# EAGLE schematic 22257 v8 (EAGLE 9.7.0)

## Sheet 1 of 2: Microzed Headers
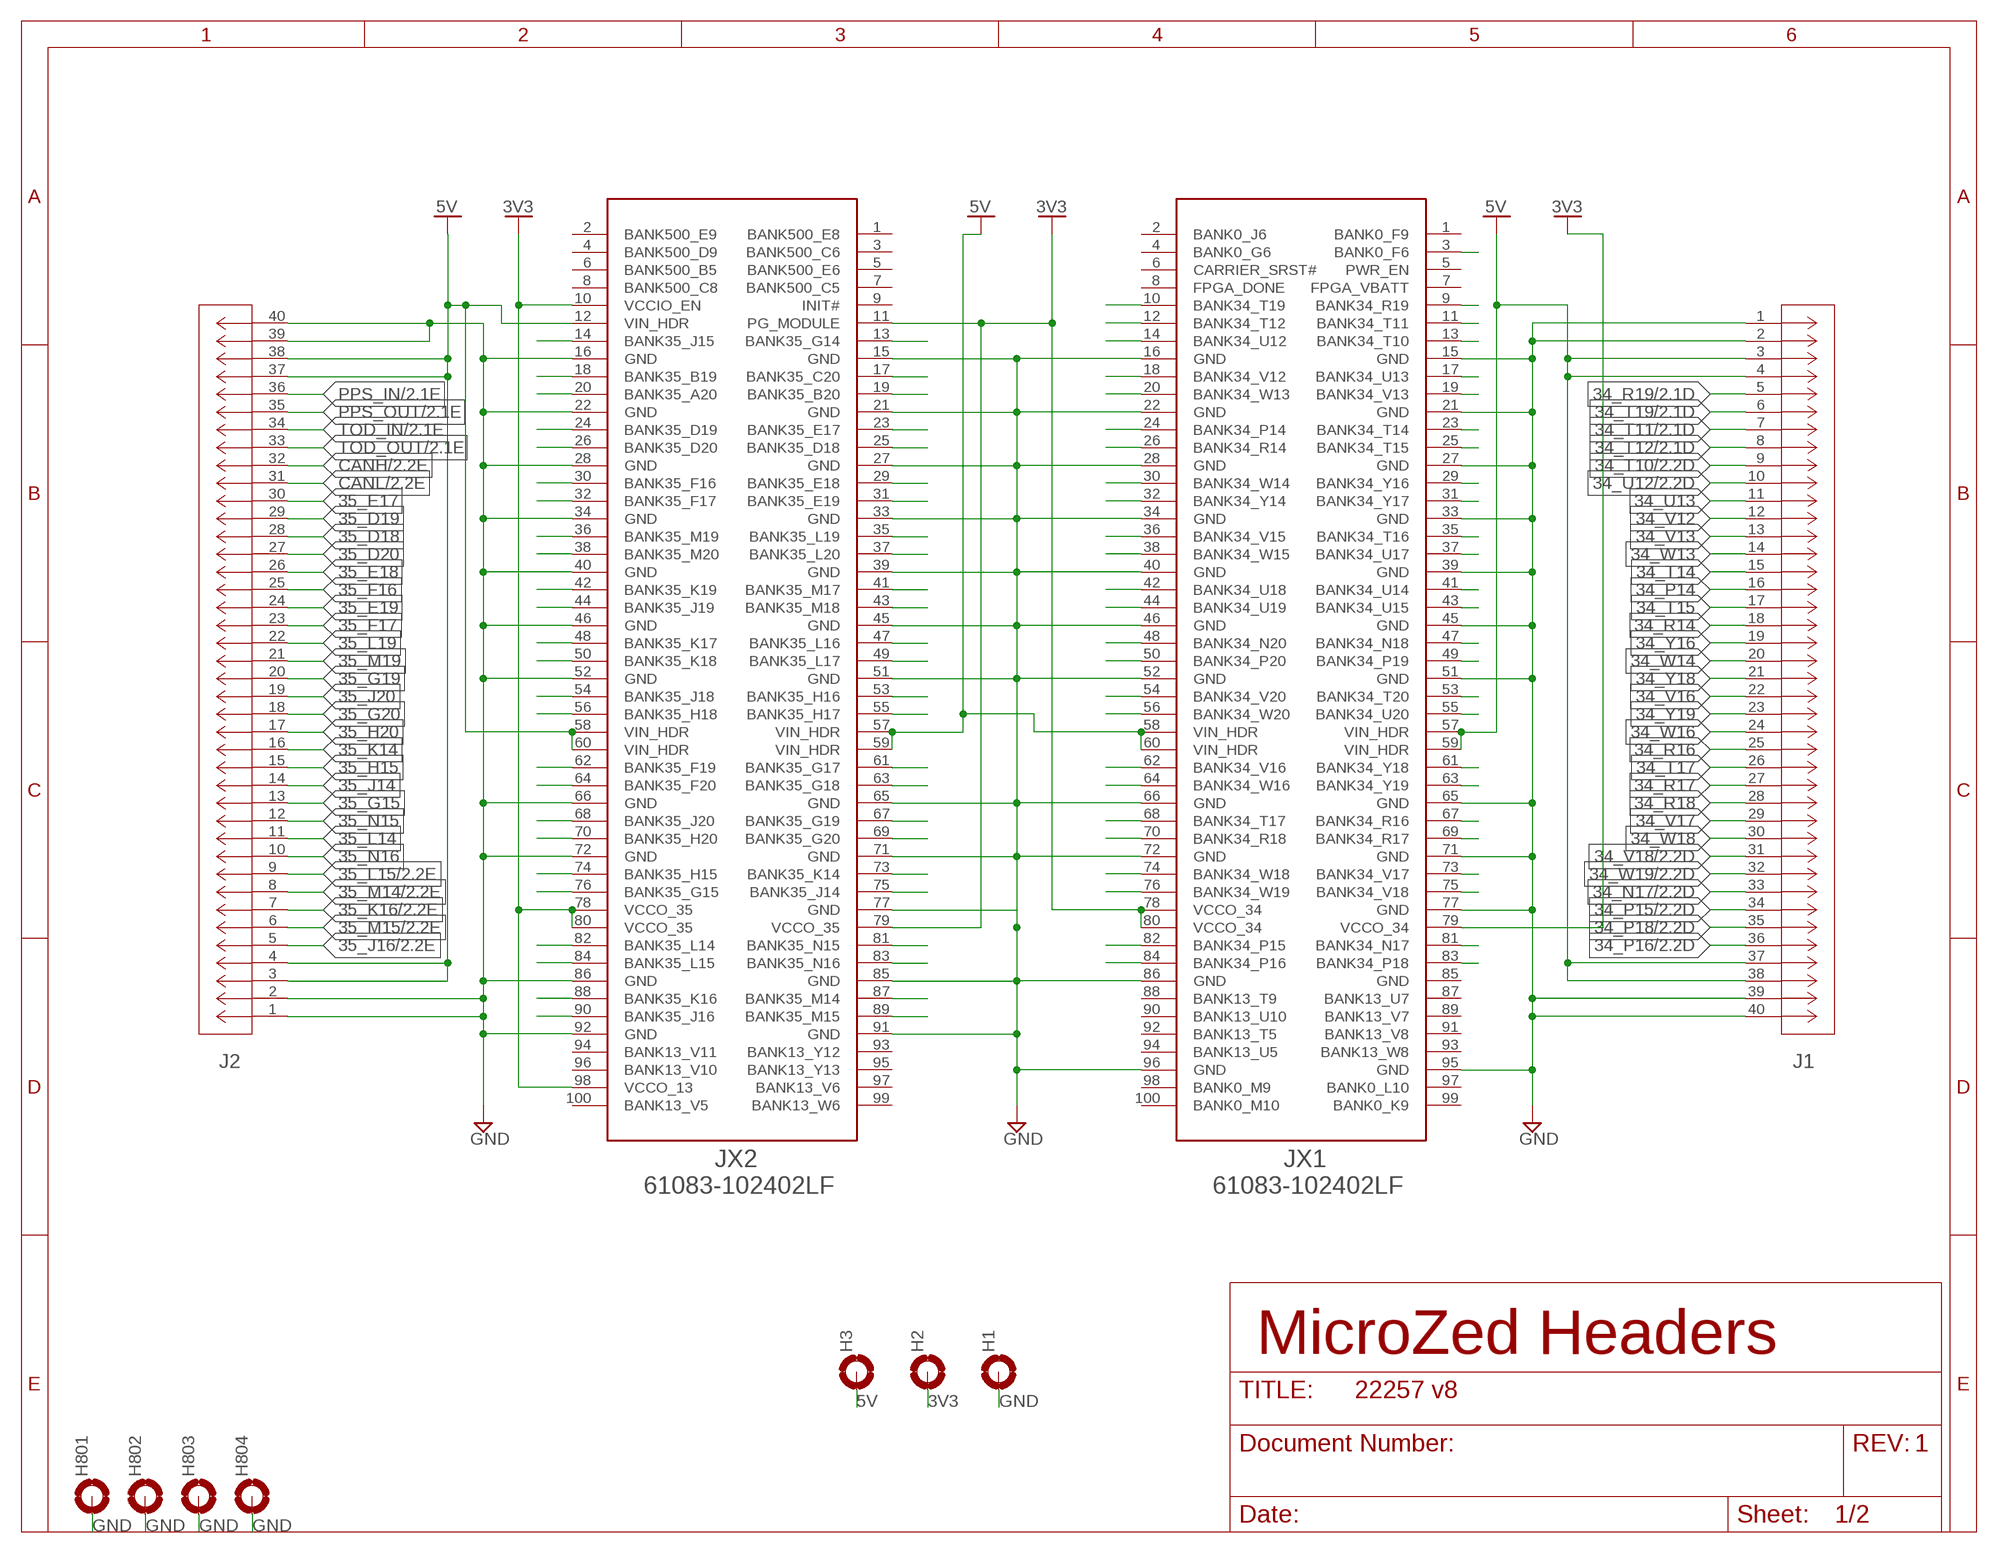
[diagram p0: schematic, sheet 1]

### Parts
H1  MOUNT-PAD-ROUND5.0  [5,0-PAD]
H2  MOUNT-PAD-ROUND5.0  [5,0-PAD]
H3  MOUNT-PAD-ROUND5.0  [5,0-PAD]
H801  MOUNT-PAD-ROUND5.0  [5,0-PAD]
H802  MOUNT-PAD-ROUND5.0  [5,0-PAD]
H803  MOUNT-PAD-ROUND5.0  [5,0-PAD]
H804  MOUNT-PAD-ROUND5.0  [5,0-PAD]
J1  TD-120-G-AACON40_2X20_TU_HTS_SAI  [CON40_2X20_TU_HTS_SAI]
J2  TD-120-G-AACON40_2X20_TU_HTS_SAI  [CON40_2X20_TU_HTS_SAI]
JX1  61083-102402LF  61083-102402LF-JX1  [61083-102402LF]
JX2  61083-102402LF  61083-102402LF-JX2  [61083-102402LF]

### Nets
3V3: H2.B5(MOUNT) JX1.78(VCCO_34) JX1.79(VCCO_34) JX1.80(VCCO_34) JX2.10(VCCIO_EN) JX2.11(PG_MODULE) JX2.78(VCCO_35) JX2.79(VCCO_35) JX2.80(VCCO_35) JX2.98(VCCO_13) ; also sheet 2
5V: H3.B5(MOUNT) J1.3 J1.4 J1.37 J1.38 J2.3 J2.4 J2.37 J2.38 JX1.57(VIN_HDR) JX1.58(VIN_HDR) JX1.59(VIN_HDR) JX1.60(VIN_HDR) JX2.12(VIN_HDR) JX2.57(VIN_HDR) JX2.58(VIN_HDR) JX2.59(VIN_HDR) JX2.60(VIN_HDR) ; also sheet 2
34_N17: J1.33 JX1.81(BANK34_N17) ; also sheet 2
34_N18: JX1.47(BANK34_N18)
34_N20: JX1.48(BANK34_N20)
34_P14: J1.16 JX1.24(BANK34_P14)
34_P15: J1.34 JX1.82(BANK34_P15) ; also sheet 2
34_P16: J1.36 JX1.84(BANK34_P16) ; also sheet 2
34_P18: J1.35 JX1.83(BANK34_P18) ; also sheet 2
34_P19: JX1.49(BANK34_P19)
34_P20: JX1.50(BANK34_P20)
34_R14: J1.18 JX1.26(BANK34_R14)
34_R16: J1.25 JX1.67(BANK34_R16)
34_R17: J1.27 JX1.69(BANK34_R17)
34_R18: J1.28 JX1.70(BANK34_R18)
34_R19: J1.5 JX1.9(BANK34_R19) ; also sheet 2
34_T10: J1.9 JX1.13(BANK34_T10) ; also sheet 2
34_T11: J1.7 JX1.11(BANK34_T11) ; also sheet 2
34_T12: J1.8 JX1.12(BANK34_T12) ; also sheet 2
34_T14: J1.15 JX1.23(BANK34_T14)
34_T15: J1.17 JX1.25(BANK34_T15)
34_T16: JX1.35(BANK34_T16)
34_T17: J1.26 JX1.68(BANK34_T17)
34_T19: J1.6 JX1.10(BANK34_T19) ; also sheet 2
34_T20: JX1.53(BANK34_T20)
34_U12: J1.10 JX1.14(BANK34_U12) ; also sheet 2
34_U13: J1.11 JX1.17(BANK34_U13)
34_U14: JX1.41(BANK34_U14)
34_U15: JX1.43(BANK34_U15)
34_U17: JX1.37(BANK34_U17)
34_U18: JX1.42(BANK34_U18)
34_U19: JX1.44(BANK34_U19)
34_U20: JX1.55(BANK34_U20)
34_V12: J1.12 JX1.18(BANK34_V12)
34_V13: J1.13 JX1.19(BANK34_V13)
34_V15: JX1.36(BANK34_V15)
34_V16: J1.22 JX1.62(BANK34_V16)
34_V17: J1.29 JX1.73(BANK34_V17)
34_V18: J1.31 JX1.75(BANK34_V18) ; also sheet 2
34_V20: JX1.54(BANK34_V20)
34_W13: J1.14 JX1.20(BANK34_W13)
34_W14: J1.20 JX1.30(BANK34_W14)
34_W15: JX1.38(BANK34_W15)
34_W16: J1.24 JX1.64(BANK34_W16)
34_W18: J1.30 JX1.74(BANK34_W18)
34_W19: J1.32 JX1.76(BANK34_W19) ; also sheet 2
34_W20: JX1.56(BANK34_W20)
34_Y14: JX1.32(BANK34_Y14)
34_Y16: J1.19 JX1.29(BANK34_Y16)
34_Y17: JX1.31(BANK34_Y17)
34_Y18: J1.21 JX1.61(BANK34_Y18)
34_Y19: J1.23 JX1.63(BANK34_Y19)
35_A20: JX2.20(BANK35_A20)
35_B19: JX2.18(BANK35_B19)
35_B20: JX2.19(BANK35_B20)
35_C20: JX2.17(BANK35_C20)
35_D18: J2.28 JX2.25(BANK35_D18)
35_D19: J2.29 JX2.24(BANK35_D19)
35_D20: J2.27 JX2.26(BANK35_D20)
35_E17: J2.30 JX2.23(BANK35_E17)
35_E18: J2.26 JX2.29(BANK35_E18)
35_E19: J2.24 JX2.31(BANK35_E19)
35_F16: J2.25 JX2.30(BANK35_F16)
35_F17: J2.23 JX2.32(BANK35_F17)
35_F19: JX2.62(BANK35_F19)
35_F20: JX2.64(BANK35_F20)
35_G14: JX2.13(BANK35_G14)
35_G15: J2.13 JX2.76(BANK35_G15)
35_G17: JX2.61(BANK35_G17)
35_G18: JX2.63(BANK35_G18)
35_G19: J2.20 JX2.67(BANK35_G19)
35_G20: J2.18 JX2.69(BANK35_G20)
35_H15: J2.15 JX2.74(BANK35_H15)
35_H16: JX2.53(BANK35_H16)
35_H17: JX2.55(BANK35_H17)
35_H18: JX2.56(BANK35_H18)
35_H20: J2.17 JX2.70(BANK35_H20)
35_J14: J2.14 JX2.75(BANK35_J14)
35_J15: JX2.14(BANK35_J15)
35_J16: J2.5 JX2.90(BANK35_J16) ; also sheet 2
35_J18: JX2.54(BANK35_J18)
35_J19: JX2.44(BANK35_J19)
35_J20: J2.19 JX2.68(BANK35_J20)
35_K14: J2.16 JX2.73(BANK35_K14)
35_K16: J2.7 JX2.88(BANK35_K16) ; also sheet 2
35_K17: JX2.48(BANK35_K17)
35_K18: JX2.50(BANK35_K18)
35_K19: JX2.42(BANK35_K19)
35_L14: J2.11 JX2.82(BANK35_L14)
35_L15: J2.9 JX2.84(BANK35_L15) ; also sheet 2
35_L16: JX2.47(BANK35_L16)
35_L17: JX2.49(BANK35_L17)
35_L19: J2.22 JX2.35(BANK35_L19)
35_L20: JX2.37(BANK35_L20)
35_M14: J2.8 JX2.87(BANK35_M14) ; also sheet 2
35_M15: J2.6 JX2.89(BANK35_M15) ; also sheet 2
35_M17: JX2.41(BANK35_M17)
35_M18: JX2.43(BANK35_M18)
35_M19: J2.21 JX2.36(BANK35_M19)
35_M20: JX2.38(BANK35_M20)
35_N15: J2.12 JX2.81(BANK35_N15)
35_N16: J2.10 JX2.83(BANK35_N16)
CANH: J2.32 ; also sheet 2
CANL: J2.31 ; also sheet 2
GND: H1.B5(MOUNT) H801.B5(MOUNT) H802.B5(MOUNT) H803.B5(MOUNT) H804.B5(MOUNT) J1.1 J1.2 J1.39 J1.40 J2.1 J2.2 J2.39 J2.40 JX1.15(GND) JX1.16(GND) JX1.21(GND) JX1.22(GND) JX1.27(GND) JX1.28(GND) JX1.33(GND) JX1.34(GND) JX1.39(GND) JX1.40(GND) JX1.45(GND) JX1.46(GND) JX1.51(GND) JX1.52(GND) JX1.65(GND) JX1.66(GND) JX1.71(GND) JX1.72(GND) JX1.77(GND) JX1.86(GND) JX1.95(GND) JX1.96(GND) JX2.15(GND) JX2.16(GND) JX2.21(GND) JX2.22(GND) JX2.27(GND) JX2.28(GND) JX2.33(GND) JX2.34(GND) JX2.39(GND) JX2.40(GND) JX2.45(GND) JX2.46(GND) JX2.51(GND) JX2.52(GND) JX2.65(GND) JX2.66(GND) JX2.71(GND) JX2.72(GND) JX2.77(GND) JX2.85(GND) JX2.86(GND) JX2.91(GND) JX2.92(GND) ; also sheet 2
PPS_IN: J2.36 ; also sheet 2
PPS_OUT: J2.35 ; also sheet 2
PWR_EN: JX1.3(BANK0_F6) ; also sheet 2
TOD_IN: J2.34 ; also sheet 2
TOD_OUT: J2.33 ; also sheet 2
Unconnected: JX1.1(BANK0_F9) JX1.2(BANK0_J6) JX1.4(BANK0_G6) JX1.5(PWR_EN) JX1.6(CARRIER_SRST#) JX1.7(FPGA_VBATT) JX1.8(FPGA_DONE) JX1.85(GND) JX1.87(BANK13_U7) JX1.88(BANK13_T9) JX1.89(BANK13_V7) JX1.90(BANK13_U10) JX1.91(BANK13_V8) JX1.92(BANK13_T5) JX1.93(BANK13_W8) JX1.94(BANK13_U5) JX1.97(BANK0_L10) JX1.98(BANK0_M9) JX1.99(BANK0_K9) JX1.100(BANK0_M10) JX2.1(BANK500_E8) JX2.2(BANK500_E9) JX2.3(BANK500_C6) JX2.4(BANK500_D9) JX2.5(BANK500_E6) JX2.6(BANK500_B5) JX2.7(BANK500_C5) JX2.8(BANK500_C8) JX2.9(INIT#) JX2.93(BANK13_Y12) JX2.94(BANK13_V11) JX2.95(BANK13_Y13) JX2.96(BANK13_V10) JX2.97(BANK13_V6) JX2.99(BANK13_W6) JX2.100(BANK13_V5)

### Notes on the sheet
- MicroZed Headers
- 1

## Sheet 2 of 2: Input/Output Circuitry
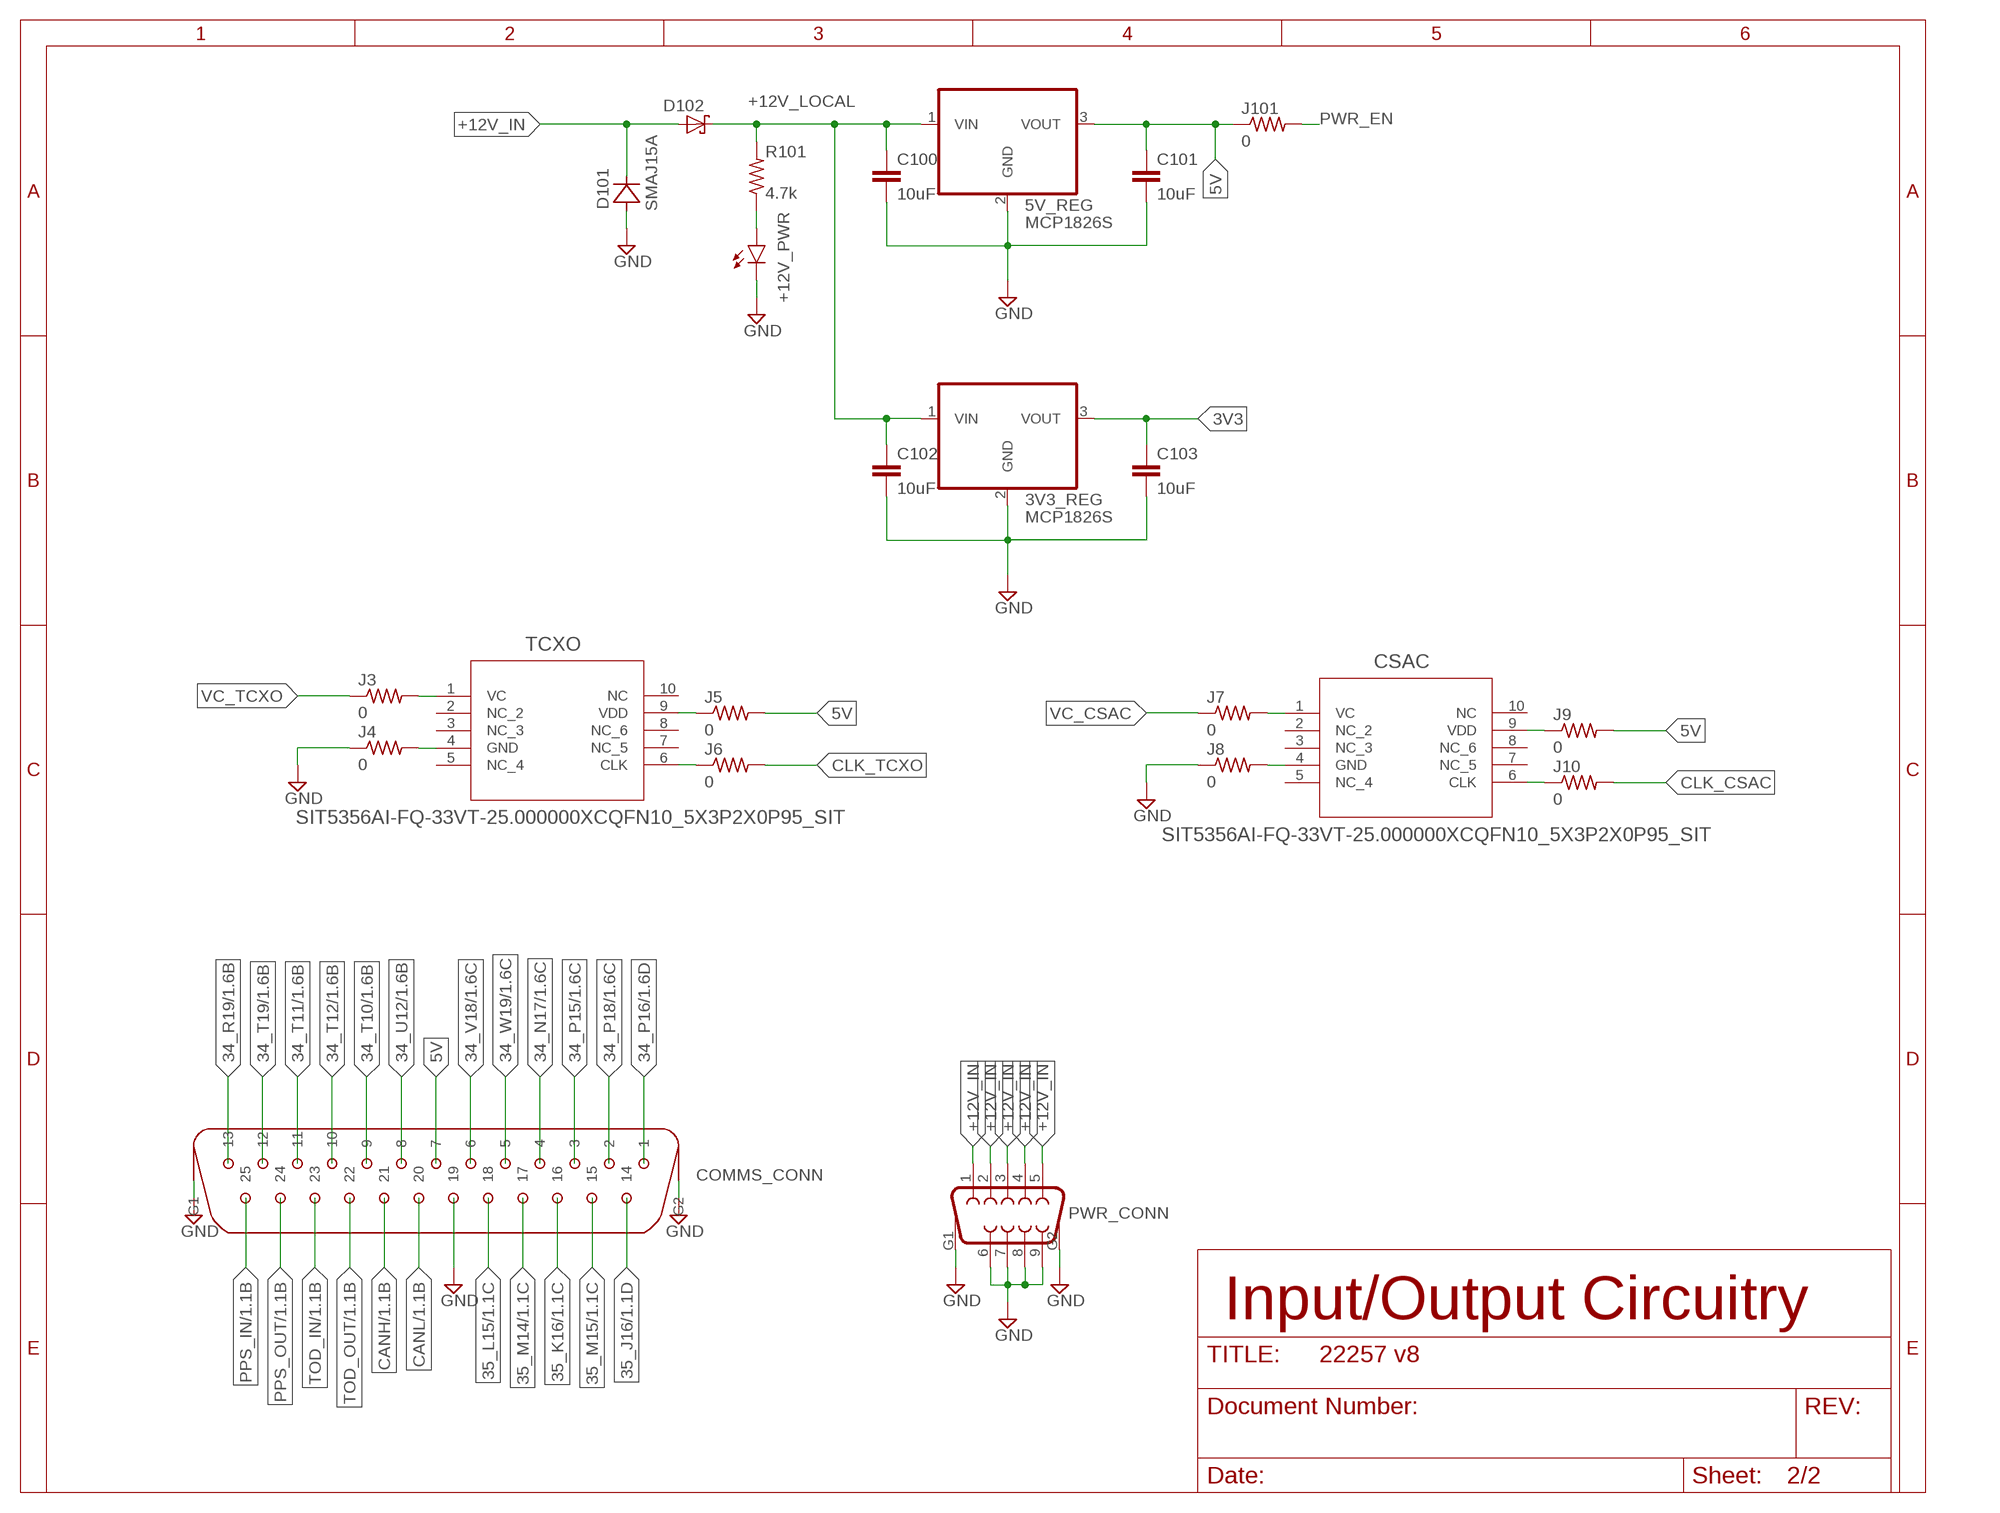
[diagram p1: schematic, sheet 2]

### Parts
3V3_REG  MCP1826S  [TO220-3]
5V_REG  MCP1826S  [TO220-3]
+12V_PWR  LEDCHIP-LED0603  [CHIP-LED0603]
C100  10uF  C-EUC0805  [C0805]
C101  10uF  C-EUC0805  [C0805]
C102  10uF  C-EUC0805  [C0805]
C103  10uF  C-EUC0805  [C0805]
COMMS_CONN  M25HP  [M25HP]
CSAC  SIT5356AI-FQ-33VT-25.000000XCQFN10_5X3P2X0P95_SIT  [CQFN10_5X3P2X0P95_SIT]
D101  SMAJ15A  MBRA340T3  [SMA]
D102  SCHOTTKY-DIODESMC  [SMC]
J3  0  R-US_R0603  [R0603]
J4  0  R-US_R0603  [R0603]
J5  0  R-US_R0603  [R0603]
J6  0  R-US_R0603  [R0603]
J7  0  R-US_R0603  [R0603]
J8  0  R-US_R0603  [R0603]
J9  0  R-US_R0603  [R0603]
J10  0  R-US_R0603  [R0603]
J101  0  R-US_R0603  [R0603]
PWR_CONN  DSUB9PIN  [DSUB9HP]
R101  4.7k  R-US_R0603  [R0603]
TCXO  SIT5356AI-FQ-33VT-25.000000XCQFN10_5X3P2X0P95_SIT  [CQFN10_5X3P2X0P95_SIT]

### Nets
3V3: 3V3_REG.3(VOUT) C103.1 ; also sheet 1
5V: 5V_REG.3(VOUT) C101.1 COMMS_CONN.7 J5.2 J9.2 J101.1 ; also sheet 1
34_N17: COMMS_CONN.4 ; also sheet 1
34_P15: COMMS_CONN.3 ; also sheet 1
34_P16: COMMS_CONN.1 ; also sheet 1
34_P18: COMMS_CONN.2 ; also sheet 1
34_R19: COMMS_CONN.13 ; also sheet 1
34_T10: COMMS_CONN.9 ; also sheet 1
34_T11: COMMS_CONN.11 ; also sheet 1
34_T12: COMMS_CONN.10 ; also sheet 1
34_T19: COMMS_CONN.12 ; also sheet 1
34_U12: COMMS_CONN.8 ; also sheet 1
34_V18: COMMS_CONN.6 ; also sheet 1
34_W19: COMMS_CONN.5 ; also sheet 1
35_J16: COMMS_CONN.14 ; also sheet 1
35_K16: COMMS_CONN.16 ; also sheet 1
35_L15: COMMS_CONN.18 ; also sheet 1
35_M14: COMMS_CONN.17 ; also sheet 1
35_M15: COMMS_CONN.15 ; also sheet 1
+12V_IN: D101.C D102.A PWR_CONN.1 PWR_CONN.2 PWR_CONN.3 PWR_CONN.4 PWR_CONN.5
+12V_LOCAL: 3V3_REG.1(VIN) 5V_REG.1(VIN) C100.1 C102.1 D102.C R101.2
CANH: COMMS_CONN.21 ; also sheet 1
CANL: COMMS_CONN.20 ; also sheet 1
CLK_CSAC: J10.2
CLK_TCXO: J6.2
GND: 3V3_REG.2(GND) 5V_REG.2(GND) +12V_PWR.C C100.2 C101.2 C102.2 C103.2 COMMS_CONN.19 COMMS_CONN.G1 COMMS_CONN.G2 D101.A J4.1 J8.1 PWR_CONN.6 PWR_CONN.7 PWR_CONN.8 PWR_CONN.9 PWR_CONN.G1 PWR_CONN.G2 ; also sheet 1
N$1: +12V_PWR.A R101.1
N$15: J3.2 TCXO.1(VC)
N$16: J4.2 TCXO.4(GND)
N$17: J6.1 TCXO.6(CLK)
N$18: J5.1 TCXO.9(VDD)
N$19: CSAC.4(GND) J8.2
N$20: CSAC.1(VC) J7.2
N$27: CSAC.9(VDD) J9.1
N$28: CSAC.6(CLK) J10.1
PPS_IN: COMMS_CONN.25 ; also sheet 1
PPS_OUT: COMMS_CONN.24 ; also sheet 1
PWR_EN: J101.2 ; also sheet 1
TOD_IN: COMMS_CONN.23 ; also sheet 1
TOD_OUT: COMMS_CONN.22 ; also sheet 1
VC_CSAC: J7.1
VC_TCXO: J3.1
Unconnected: CSAC.2(NC_2) CSAC.3(NC_3) CSAC.5(NC_4) CSAC.7(NC_5) CSAC.8(NC_6) CSAC.10(NC) TCXO.2(NC_2) TCXO.3(NC_3) TCXO.5(NC_4) TCXO.7(NC_5) TCXO.8(NC_6) TCXO.10(NC)

### Notes on the sheet
- Input/Output Circuitry

## Library data of the parts
3V3_REG 5V_REG = interface_board:MCP1826S
+12V_PWR = led:LED: LED OSRAM: - CHIPLED LG R971, LG N971, LY N971, LG Q971, LY Q971, LO R971, LY R971 LH N974, LH R974 LS Q976, LO Q976, LY Q976 LO Q996 - Hyper CHIPLED LW Q18S LB Q993, LB Q99A, LB R99A - SideLED LS A670, LO A670, LY A670, LG A670, LP A670 LB A673, LV A673, LT A673, LW A673 LH A674 LY A675 LS A676, LA A676, LO A676, LY A676, LW A676 LS A679, LY A679, LG A679 - Hyper Micro SIDELED® LS Y876, LA Y876, LO Y876, LY Y876 LT Y87S - SmartLED LW L88C, LW L88S LB L89C, LB L89S, LG L890 LS L89K, LO L89K, LY L89K LS L896, LA L896, LO L896, LY L896 - TOPLED LS T670, LO T670, LY T670, LG T670, LP T670 LSG T670, LSP T670, LSY T670, LOP T670, LYG T670 LG T671, LOG T671, LSG T671 LB T673, LV T673, LT T673, LW T673 LH T674 LS T676, LA T676, LO T676, LY T676, LB T676, LH T676, LSB T676, LW T676 LB T67C, LV T67C, LT T67C, LS T67K, LO T67K, LY T67K, LW E67C LS E67B, LA E67B, LO E67B, LY E67B, LB E67C, LV E67C, LT E67C LW T67C LS T679, LY T679, LG T679 LS T770, LO T770, LY T770, LG T770, LP T770 LB T773, LV T773, LT T773, LW T773 LH T774 LS E675, LA E675, LY E675, LS T675 LS T776, LA T776, LO T776, LY T776, LB T776 LHGB T686 LT T68C, LB T68C - Hyper Mini TOPLED® LB M676 - Mini TOPLED Santana® LG M470 LS M47K, LO M47K, LY M47K Source: http://www.osram.convergy.de LUXEON: - LUMILED® LXK2-PW12-R00, LXK2-PW12-S00, LXK2-PW14-U00, LXK2-PW14-V00 LXK2-PM12-R00, LXK2-PM12-S00, LXK2-PM14-U00 LXK2-PE12-Q00, LXK2-PE12-R00, LXK2-PE12-S00, LXK2-PE14-T00, LXK2-PE14-U00 LXK2-PB12-K00, LXK2-PB12-L00, LXK2-PB12-M00, LXK2-PB14-N00, LXK2-PB14-P00, LXK2-PB14-Q00 LXK2-PR12-L00, LXK2-PR12-M00, LXK2-PR14-Q00, LXK2-PR14-R00 LXK2-PD12-Q00, LXK2-PD12-R00, LXK2-PD12-S00 LXK2-PH12-R00, LXK2-PH12-S00 LXK2-PL12-P00, LXK2-PL12-Q00, LXK2-PL12-R00 Source: www.luxeon.com KINGBRIGHT: KA-3528ASYC Source: www.kingbright.com
C100-C103 = rcl:C-EU: CAPACITOR, European symbol; SPICEPREFIX: C
COMMS_CONN = interface_board:M25HP: SUB-D; OC_FARNELL: unknown; OC_NEWARK: unknown
CSAC TCXO = 2024-12-02_23-14-43_Library:SIT5356AI-FQ-33VT-25.000000X; COPYRIGHT: Copyright (C) 2024 Ultra Librarian. All rights reserved.; MANUFACTURER_PART_NUMBER: SIT5356AI-FQ-33VT-25.000000X; MFR_NAME: SiTime; TYPE: Oscillators
D101 = diode:MBRA340T3: Surface Mount Schottky Power Rectifier Source: http://www.onsemi.com/pub_link/Collateral/MBRA340T3-D.PDF
D102 = diode:SCHOTTKY-DIODE: Schottky Diode
H1-H3 H801-H804 = holes:MOUNT-PAD-ROUND: MOUNTING PAD, round
J1 J2 = 2024-11-13_22-37-46_Library:TD-120-G-AA; COPYRIGHT: Copyright (C) 2024 Ultra Librarian. All rights reserved.; MANUFACTURER_PART_NUMBER: TD-120-G-AA; MFR_NAME: Samtec Inc
J3-J10 J101 R101 = rcl:R-US_: RESISTOR, American symbol; SPICEPREFIX: R
JX1 = interface_board:61083-102402LF-JX1
JX2 = interface_board:61083-102402LF-JX2
PWR_CONN = interface_board:DSUB9PIN: SUB-D